# EAGLE design Digital Pressure Sensor_3V (EAGLE 7.2.0)
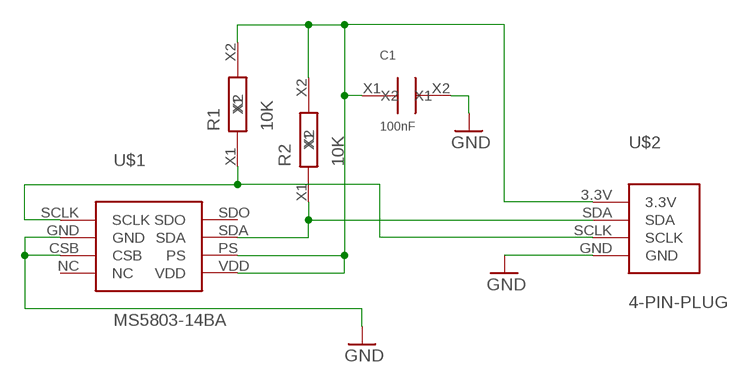
[diagram p0: schematic, sheet 1]

## Parts
C1  100nF  C_SMD_2.1X1.25_BOTTOM  [SMD_2.1X1.25_BOTTOM]
R1  10K  R_SMD_2.1X1.25_BOTTOM  [SMD_2.1X1.25_BOTTOM]
R2  10K  R_SMD_2.1X1.25_BOTTOM  [SMD_2.1X1.25_BOTTOM]
U$1  MS5803-14BA  [MS5803-14BA]
U$2  4-PIN-PLUG  [4-PIN-PLUG]

## Nets
GND: C1.X2 U$1.CSB U$1.GND U$2.GND
N$1: R2.X1 U$1.SDA U$2.SDA
N$2: R1.X1 U$1.SCLK U$2.SCLK
N$4: C1.X1 R1.X2 R2.X2 U$1.PS U$1.VDD U$2.3.3V
Unconnected: U$1.NC U$1.SDO

## Library data of the parts
C1 = MyPowerComponents:C_SMD_2.1X1.25_BOTTOM
R1 R2 = MyPowerComponents:R_SMD_2.1X1.25_BOTTOM
U$1 = MyAmSys:MS5803-14BA
U$2 = MyAmSys:4-PIN-PLUG

## Board
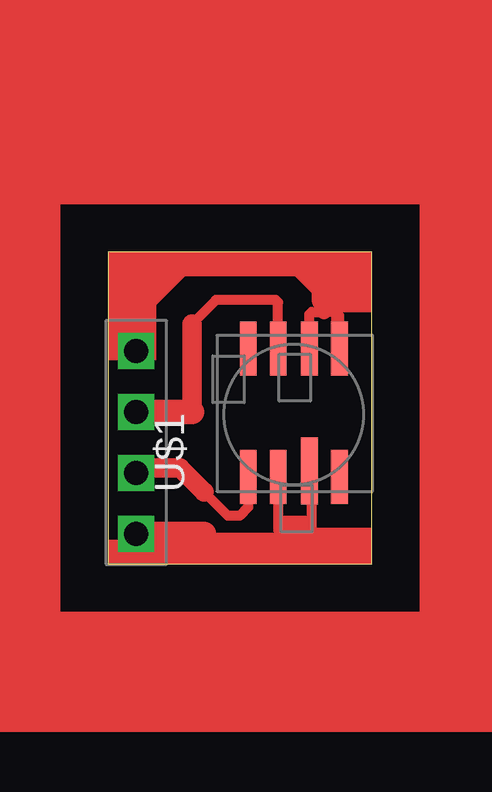
[diagram p1: board, top side]
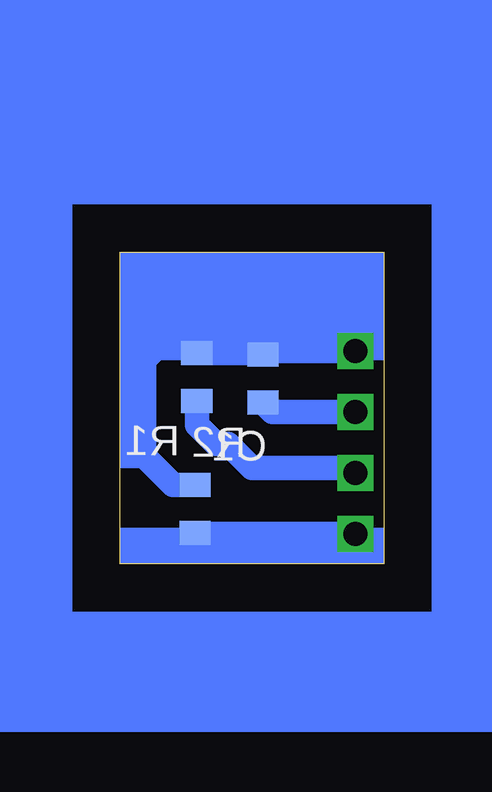
[diagram p2: board, bottom side, seen from below]

Size 11 x 13 mm. Coordinates in mm from the lower left corner, seen from the top.
Outline: 0,0 11,0 11,13 0,13 0,0
Copper layers (1*16): Top 0.035mm / dielectric 1.5mm / Bottom 0.035mm
Design rules "default": minimum track width 10mil, minimum drill 24mil, track to track 8mil, track to pad 8mil, pad to pad 8mil, via to via 8mil, smd to smd 8mil, copper to edge 40mil, drill to drill 8mil, minimum pad ring 10mil, minimum via ring 8mil, stop-mask expansion 4mil, vias tented up to drill 0mil, thermal gap 10mil

### Footprints (pad centres in the part's own frame; a part is rotated, then mirrored left to right if it is on the bottom)
SMD_2.1X1.25_BOTTOM = smd 1.3 x 1 bottom: X1 0,1; X2 0,-1
MS5803-14BA = smd 2.8 x 0.7: CSB 0.25,-1.3 | smd 2.25 x 0.7: GND 0,0; NC 0,-2.55; PS 5.35,-1.3; SCLK 0,1.25; SDA 5.35,0; SDO 5.35,1.25; VDD 5.35,-2.55
4-PIN-PLUG = drill 1 square: 3.3V 0,2.54; GND 0,-5.08; SCLK 0,-2.54; SDA 0,0

### Placement (x,y rotation side)
C1  7.87,2.28 0 top
R1  7.79,7.78 180 top
R2  5.03,7.71 180 top
U$1  7.1,3.62 90 top
U$2  1.18,6.32 0 top

### Tracks (layer width: path | path; a pad name or v marks a point on that pad's centre or on a via)
GND
  Top 0.406: U$1.GND 7.1,1.4 7.5,1 8,1 8.5,1.5 8.5,3.77 U$1.CSB
  Top 0.61: 8,1 4.24,1 4,1.24
  Top 1.016: 4,1.24 U$2.GND
  Bottom 1.016: U$2.GND 7.83,1.24 C1.X2
N$1
  Top 0.406: U$1.SDA 7.1,10.9 7,11 4.5,11 3.5,10
  Top 0.813: 3.5,10 3.5,6.32
  Top 1.016: 3.5,6.32 U$2.SDA
  Bottom 1.016: U$2.SDA 4.64,6.32 R2.X1
N$2
  Top 0.406: U$1.SCLK 5.85,2.35 5.5,2 5,2 4,3
  Top 0.813: 4,3 3,4 1.4,4 U$2.SCLK
  Bottom 1.016: R1.X1 7.79,5.79 7,5 6.5,5 5.5,4 1.4,4 U$2.SCLK
N$4
  Top 0.406: U$1.PS 8.4,10.4 8.5,10.5 9,10.5 9.5,10.5 | 9.5,10.5 9.5,9.12 U$1.VDD 9.65,10.35 9.5,10.5
  Top 0.61: 9,10.5 9,11
  Top 1.016: 9,11 9,11.5 8,12.5 3,12.5 1.5,11 1.5,9.18 U$2.3.3V
  Bottom 1.016: R1.X2 5.1,8.78 R2.X2 4.88,8.86 U$2.3.3V 1.32,9 9.5,9 10,8.5 10,4.5 8.78,3.28 C1.X1
(copper drawn outside any net)
  shapes: Bottom area x8, Top area x13